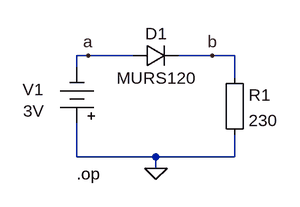
[diagram p0: schematic diode-op-reverse.asc]
diode-op-reverse.asc, the LTspice schematic file:
Version 4
SHEET 1 880 680
WIRE -48 208 -64 208
WIRE 16 208 -48 208
WIRE 128 208 80 208
WIRE 160 208 128 208
WIRE -64 224 -64 208
WIRE 160 240 160 208
WIRE -64 352 -64 304
WIRE 48 352 -64 352
WIRE 160 352 160 320
WIRE 160 352 48 352
WIRE 48 368 48 352
FLAG 48 368 0
FLAG -48 208 a
FLAG 128 208 b
SYMBOL diode 16 224 R270
WINDOW 0 32 32 VTop 2
WINDOW 3 0 32 VBottom 2
SYMATTR InstName D1
SYMATTR Value MURS120
SYMBOL Misc\\EuropeanResistor 144 224 R0
SYMATTR InstName R1
SYMATTR Value 230
SYMBOL Misc\\battery -64 320 R180
WINDOW 0 48 64 Left 2
WINDOW 3 47 33 Left 2
WINDOW 123 0 0 Left 2
WINDOW 39 0 0 Left 2
SYMATTR InstName V1
SYMATTR Value 3V
TEXT -64 376 Left 2 !.op

The netlist it stands for:
* diode-op-reverse.asc
D1 a b MURS120
R1 b 0 230
V1 0 a 3V
.model D D
.lib standard.dio
.op
.backanno
.end